# EAGLE design schematic_V3.1 (EAGLE 9.6.2)
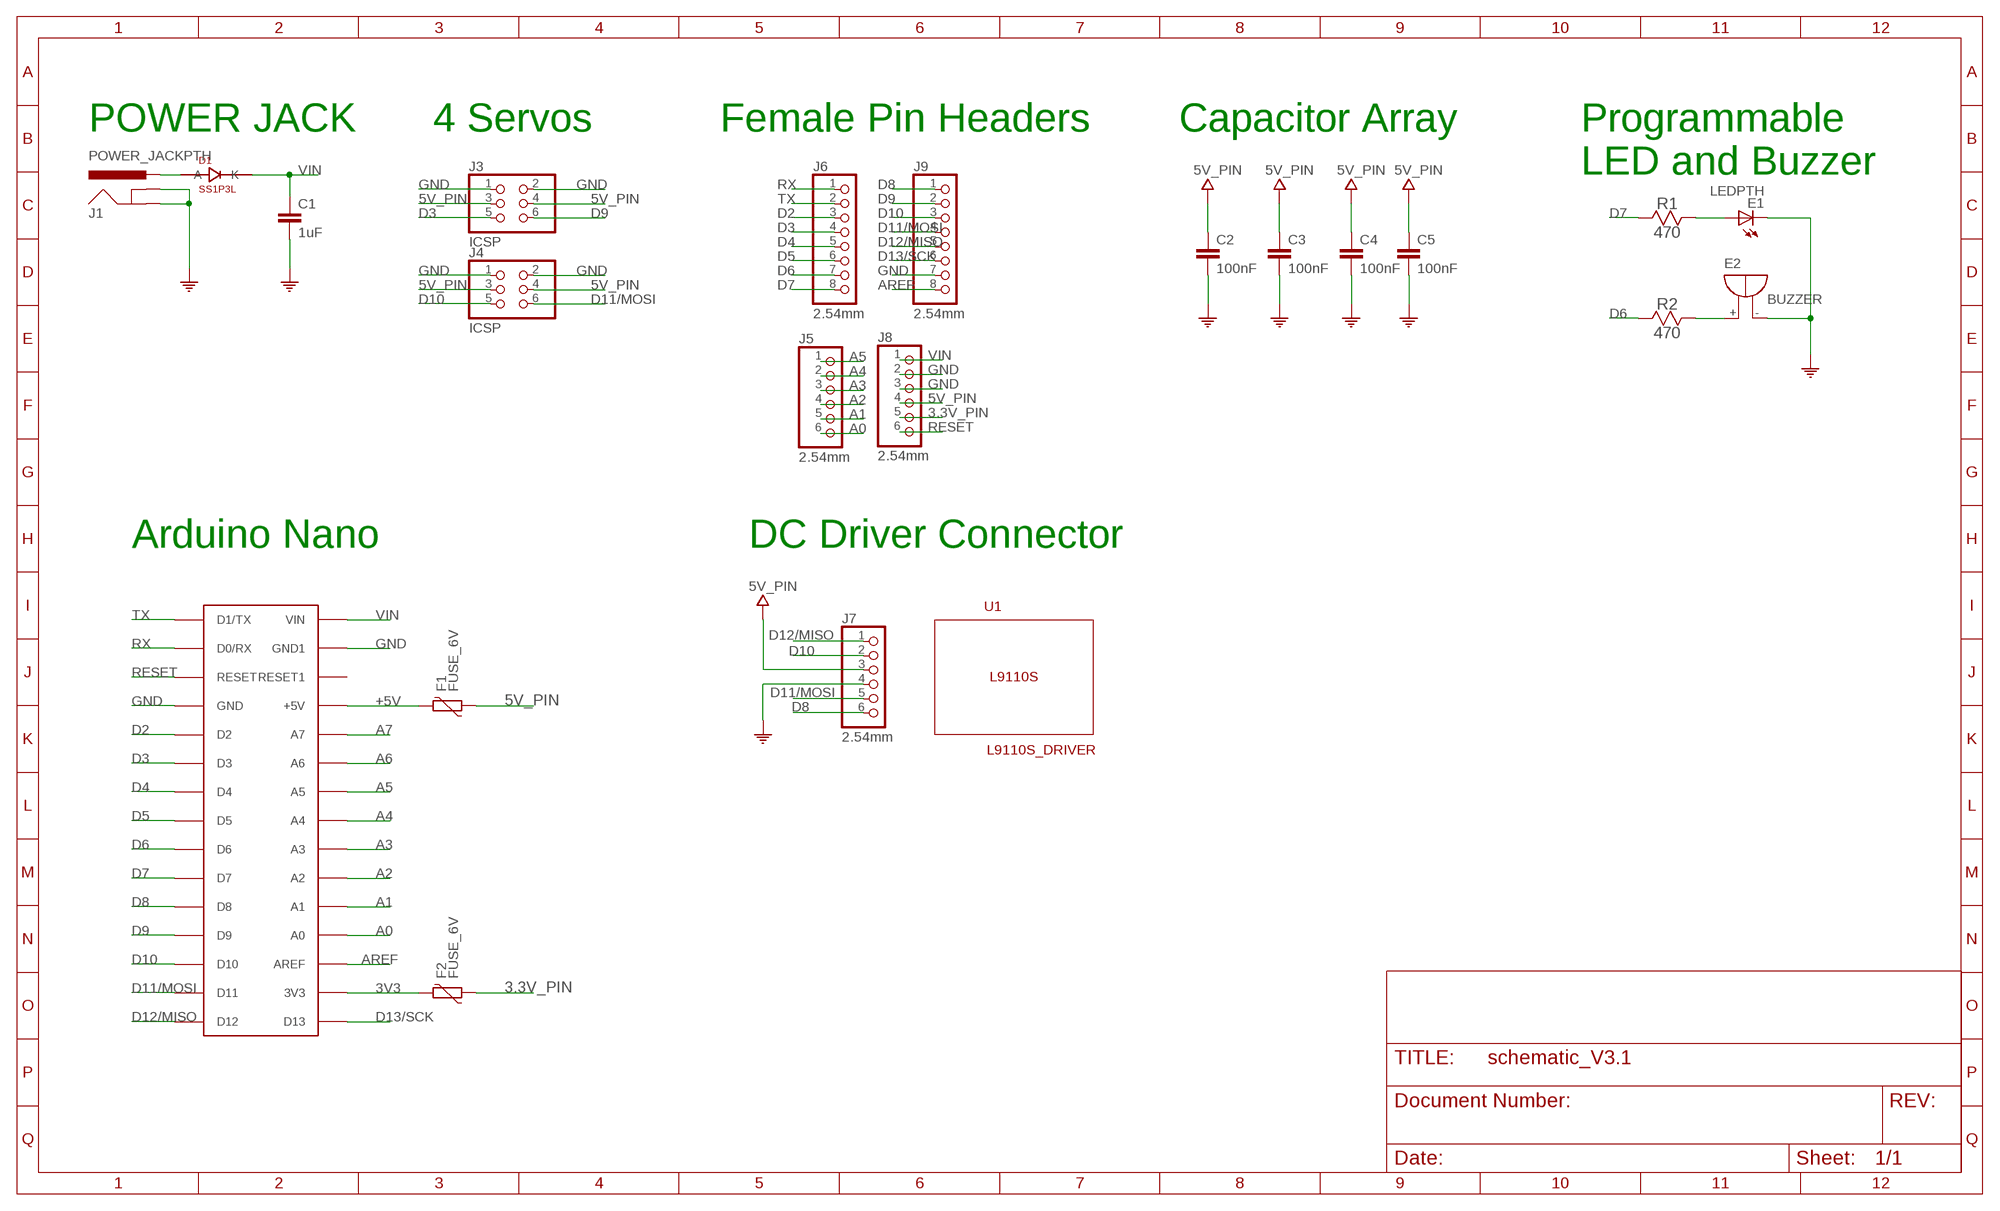
[diagram p0: schematic, sheet 1]

## Parts
C1  1uF  CAPACITOR_1UF_0603  [C0603-ROUND]
C2  100nF  CAPACITOR_100NF_0603  [C0603-ROUND]
C3  100nF  CAPACITOR_100NF_0603  [C0603-ROUND]
C4  100nF  CAPACITOR_100NF_0603  [C0603-ROUND]
C5  100nF  CAPACITOR_100NF_0603  [C0603-ROUND]
D1  SS1P3L  SCHOTTKY_DIODE  [DIODI_DO220AAL]
E1  LEDPTH  [LED5MM]
E2  BUZZER  [BUZZER]
F1  FUSE_6V  [FUSE_0603]
F2  FUSE_6V  [FUSE_0603]
J1  POWER_JACKPTH  [POWER_JACK_PTH]
J3  ICSP  CONNECTOR_2X3  [CONNECTOR_2X3]
J4  ICSP  CONNECTOR_2X3  [CONNECTOR_2X3]
J5  2.54mm  PINHD-1X6  [1X06]
J6  2.54mm  PINHD-1X8  [1X08]
J7  2.54mm  PINHD-1X6  [1X06]
J8  2.54mm  PINHD-1X6  [1X06]
J9  2.54mm  PINHD-1X8  [1X08]
R1  470  RESISTOR  [RESISTOR_PTH]
R2  470  RESISTOR  [RESISTOR_PTH]
U1  L9110S_DRIVER  [L9110S_DRIVER]
U$1  ARDUINONANO  [PDIP-32]

## Nets
3.3V_PIN: F2.1 J8.5
3V3: F2.2 U$1.3V3
5V_PIN: C2.1 C3.1 C4.1 C5.1 F1.1 J3.3 J3.4 J4.3 J4.4 J7.3 J8.4
+5V: F1.2 U$1.+5V
A0: J5.6 U$1.A7(A0)
A1: J5.5 U$1.A6(A1)
A2: J5.4 U$1.A5(A2)
A3: J5.3 U$1.A4(A3)
A4: J5.2 U$1.A3(A4)
A5: J5.1 U$1.A2(A5)
A6: U$1.A1(A6)
A7: U$1.A0(A7)
AREF: J9.8 U$1.AREF
D2: J6.3 U$1.D2
D3: J3.5 J6.4 U$1.D3
D4: J6.5 U$1.D4
D5: J6.6 U$1.D5
D6: J6.7 R2.1 U$1.D6
D7: J6.8 R1.1 U$1.D7
D8: J7.6 J9.1 U$1.D8
D9: J3.6 J9.2 U$1.D9
D10: J4.5 J7.2 J9.3 U$1.D10
D11/MOSI: J4.6 J7.5 J9.4 U$1.D11
D12/MISO: J7.1 J9.5 U$1.D12
D13/SCK: J9.6 U$1.D13
GND: C1.2 C2.2 C3.2 C4.2 C5.2 E1.K(C) E2.- J1.GND J1.GNDBREAK J3.1 J3.2 J4.1 J4.2 J7.4 J8.2 J8.3 J9.7 U$1.GND U$1.GND1
N$16: D1.P$2(A) J1.PWR
N$18: E1.A R1.2
N$19: E2.+ R2.2
RESET: J8.6 U$1.RESET
RX: J6.1 U$1.D0/RX
TX: J6.2 U$1.D1/TX
VIN: C1.1 D1.P$1(K) J8.1 U$1.VIN
Unconnected: U$1.RESET1

## Notes on the sheet
- POWER JACK | 4 Servos | Female Pin Headers | Capacitor Array
- Programmable 
  LED and Buzzer
- Arduino Nano | DC Driver Connector

## Library data of the parts
C1 = barnabas_noggin_V4:CAPACITOR_1UF_0603: 1uF 0603; PARTNO: CC0603KRX5R8BB105
C2-C5 = barnabas_noggin_V4:CAPACITOR_100NF_0603: CAP CER 0.1UF 50V Y5V 0603; PARTNO: CC0603ZRY5V9BB104
D1 = barnabas_noggin_V4:SCHOTTKY_DIODE: 1A 30V Schottky Barrier Rectifiers -SS1P3L-M3/84A; PARTNO: SS1P3L-M3/84A
E1 = barnabas_noggin_V4:LEDPTH
E2 = barnabas_noggin_V4:BUZZER: BUZZER Source: Buerklin; OC_FARNELL: unknown; OC_NEWARK: unknown
F1 F2 = barnabas_noggin_V4:FUSE_6V: SMD PTC; PARTNO: MF-FSMF050X-2
J1 = barnabas_noggin_V4:POWER_JACK: Power Jack This is the standard 5.5mm barrel jack for power. The PTH is the most common, proven, reliable, footprint. All others are experimental. The Slot footprint only works if the mill layer is transmitted to the PCB fab house so be warned. Spark Fun Electronics SKU : PRT-00119. Mating wall wart : TOL-00298 (and others); PARTNO: EJ508A
J3 J4 = barnabas_noggin_V4:CONNECTOR_2X3: 3x2 M V h 8,5 mm p2,54; PARTNO: M20-9980346
J5 J7 J8 = barnabas_noggin_V4:PINHD-1X6: PIN HEADER; PARTNO: M20-7820646
J6 J9 = barnabas_noggin_V4:PINHD-1X8: PIN HEADER; PARTNO: PPTC081LFBN-RC
R1 R2 = barnabas_noggin_V4:RESISTOR
U1 = barnabas_noggin_V4:L9110S_DRIVER
U$1 = barnabas_noggin_V4:ARDUINONANO

## Board
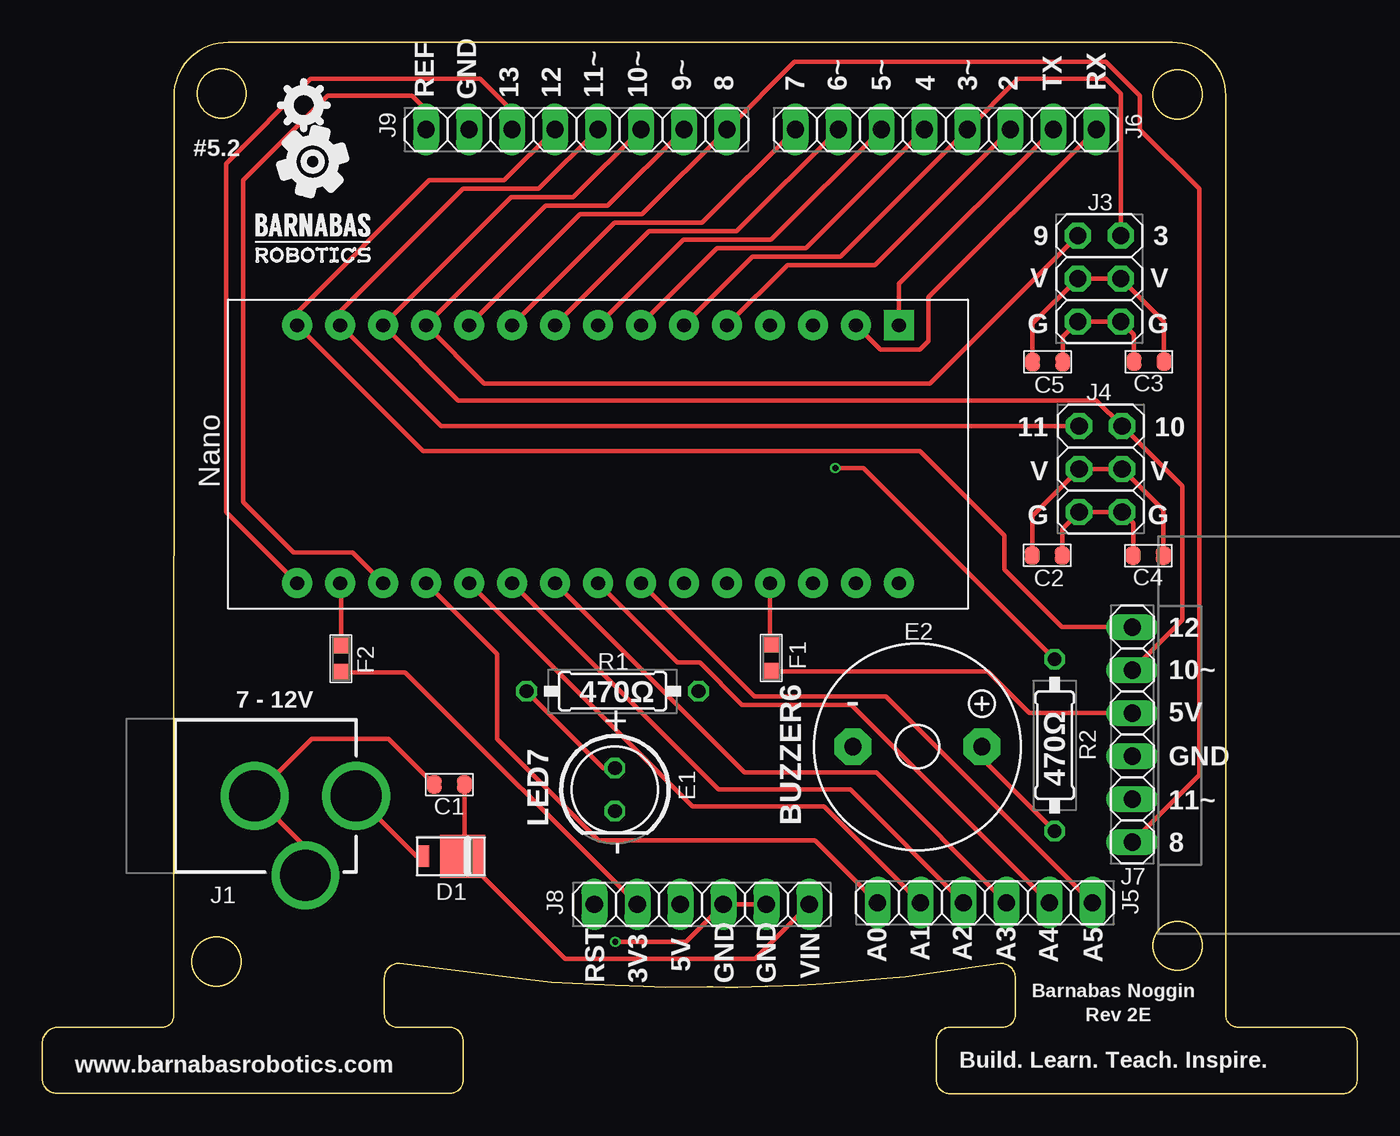
[diagram p1: board, top side]
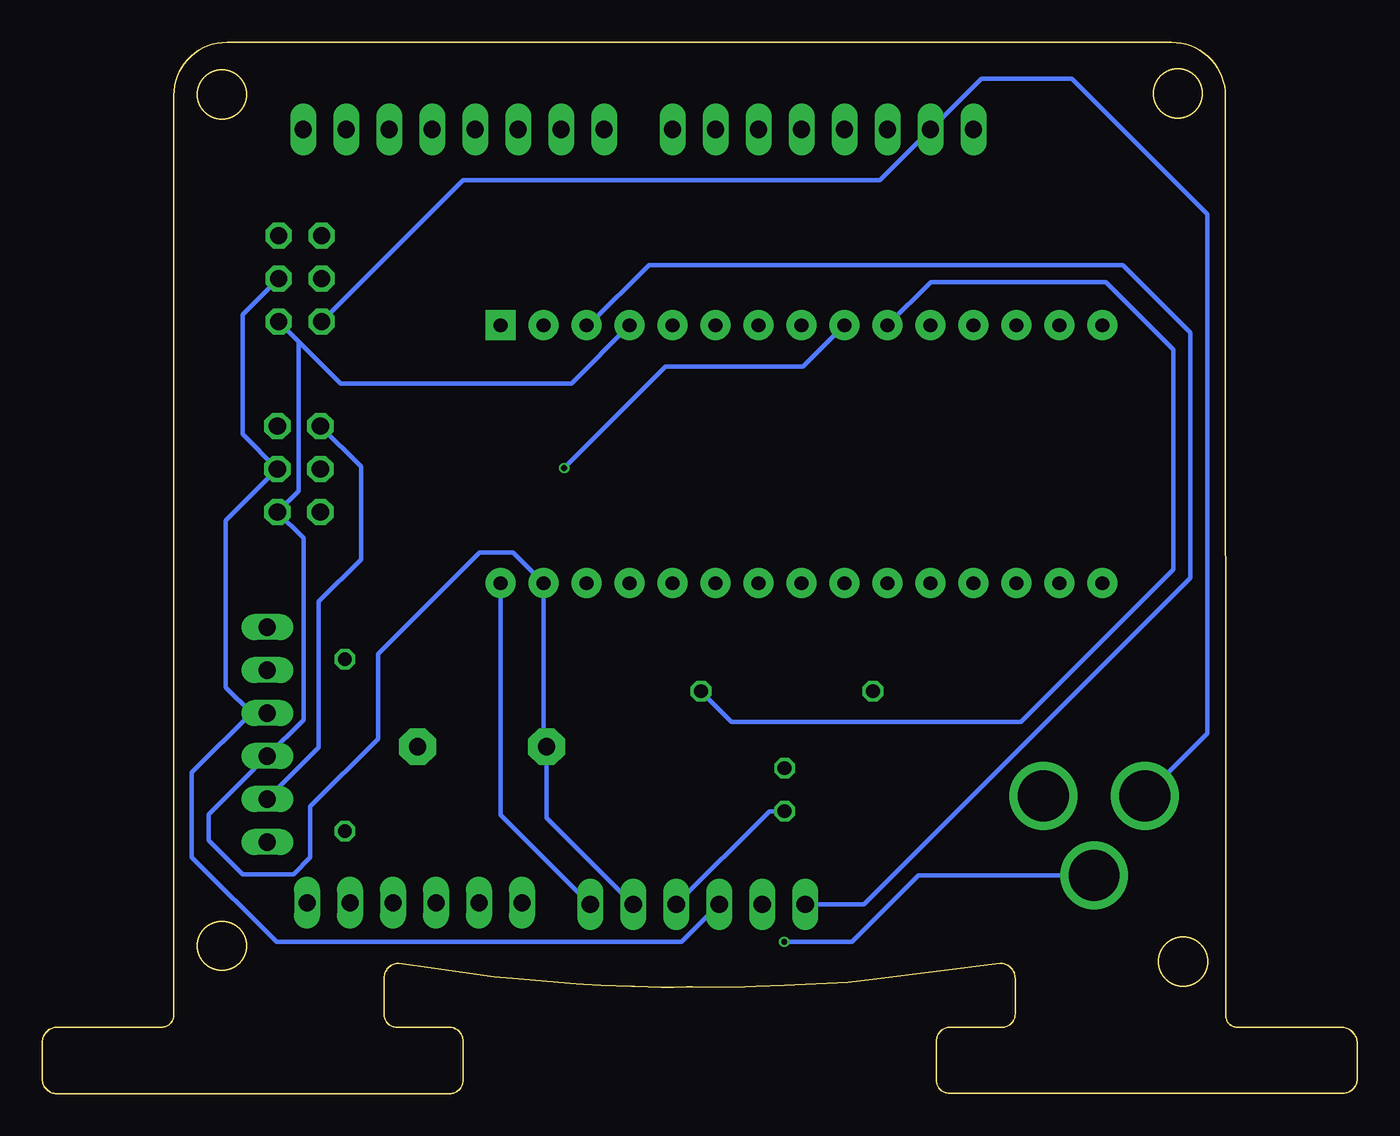
[diagram p2: board, bottom side, seen from below]

Size 77.7 x 62.13 mm. Coordinates in mm from the lower left corner, seen from the top.
Outline: 69.93,4.64 69.93,58.99 69.92,59.26 arc85 66.79,62.13 10.97,62.13 10.69,62.12 arc85 7.78,58.94 7.76,4.58 7.76,4.53 arc-85 7.11,3.93 0.96,3.93 0.88,3.93 arc85 0,2.97 0,0.86 arc90 0.83,0.03 24.13,0.03 24.2,0.03 arc85 24.86,0.76 24.86,3.13 24.86,3.2 arc85 24.07,3.92 20.99,3.92 20.92,3.92 arc-85 20.21,4.7 20.21,6.82 20.21,6.9 arc-85 21.1,7.71 28.63,6.75 30.08,6.59 33.83,6.41 35.54,6.34 36.82,6.27 39.28,6.3 39.63,6.31 40.36,6.29 40.66,6.28 41.1,6.29 42.71,6.34 42.88,6.34 44.67,6.41 45.71,6.47 46.16,6.49 49.92,6.81 51,6.91 54.53,7.39 56.63,7.71 56.7,7.71 arc-85 57.5,6.84 57.5,4.66 57.5,4.6 arc-85 56.77,3.93 53.66,3.93 53.59,3.93 arc85 52.84,3.11 52.84,0.78 52.84,0.71 arc85 53.62,0 76.86,0 76.93,0 arc85 77.7,0.84 77.7,3.03 77.7,3.11 arc85 76.8,3.93 70.64,3.93 70.58,3.93 arc-85 69.93,4.64
Outline: circle at 67.1,8.73 radius 1.45
Outline: circle at 10.6,59.12 radius 1.45
Outline: circle at 67.1,59.06 radius 1.45
Outline: circle at 10.28,7.81 radius 1.45
Copper layers (1*16): Top 0.035559375mm / dielectric 1.6mm / Bottom 0.035559375mm
Design rules "oshpark-2layer": minimum track width 6mil, minimum drill 10mil, track to track 6mil, track to pad 6mil, pad to pad 6mil, via to via 6mil, smd to smd 6mil, copper to edge 15mil, drill to drill 6mil, minimum pad ring 5mil, minimum via ring 5mil, stop-mask expansion 2.5mil, vias tented up to drill 0mil, thermal gap 10mil

### Footprints (pad centres in the part's own frame; a part is rotated, then mirrored left to right if it is on the bottom)
C0603-ROUND = smd 0.898 x 1.1: 1 -0.889,0; 2 0.889,0
DIODI_DO220AAL = smd 2.667 x 2.54: P$1 -0.7,0 | smd 0.762 x 1.27: P$2 1.65,0
LED5MM = drill 0.813 octagon: A -1.27,0; K 1.27,0
BUZZER = drill 1.016 pad 2.159 octagon: + 3.81,0; - -3.81,0
FUSE_0603 = smd 0.95 x 1: 1 -0.8,0; 2 0.8,0
POWER_JACK_PTH = drill 2.997: GND 0,7.7; GNDBREAK 4.7,10.7; PWR 0,13.7
CONNECTOR_2X3 = drill 1.016 pad 1.55 octagon: 1 -2.54,-1.27; 2 -2.54,1.27; 3 0,-1.27; 4 0,1.27; 5 2.54,-1.27; 6 2.54,1.27
1X06 = drill 1.016 long: 1 -6.35,0; 2 -3.81,0; 3 -1.27,0; 4 1.27,0; 5 3.81,0; 6 6.35,0
1X08 = drill 1.016 long: 1 -8.89,0; 2 -6.35,0; 3 -3.81,0; 4 -1.27,0; 5 1.27,0; 6 3.81,0; 7 6.35,0; 8 8.89,0
RESISTOR_PTH = drill 0.813 octagon: 1 -5.08,0; 2 5.08,0
PDIP-32 = drill 0.8 pad 1.778: 3V3 15.24,-35.56; +5V 15.24,-10.16; A0 15.24,-12.7; A1 15.24,-15.24; A2 15.24,-17.78; A3 15.24,-20.32; A4 15.24,-22.86; A5 15.24,-25.4; A6 15.24,-27.94; A7 15.24,-30.48; AREF 15.24,-33.02; D0/RX 0,-5.08; D2 0,-12.7; D3 0,-15.24; D4 0,-17.78; D5 0,-20.32; D6 0,-22.86; D7 0,-25.4; D8 0,-27.94; D9 0,-30.48; D10 0,-33.02; D11 0,-35.56; D12 0,-38.1; D13 15.24,-38.1; GND 0,-10.16; GND1 15.24,-5.08; RESET 0,-7.62; RESET1 15.24,-7.62; VIN 15.24,-2.54 | drill 0.8 pad 1.778 square: D1/TX 0,-2.54

### Placement (x,y rotation side)
C1  24.05,18.26 180 top
C2  59.38,31.81 0 top
C3  65.39,43.26 180 top
C4  65.36,31.8 180 top
C5  59.41,43.23 0 top
D1  24.14,14.03 180 top
E1  33.84,17.96 270 top
E2  51.71,20.5 0 top
F1  43.09,25.75 90 top
F2  17.65,25.7 90 top
J1  4.85,17.59 270 top
J3  62.46,48.16 90 top
J4  62.54,36.91 90 top
J5  55.7,11.28 180 top
J6  53.39,56.98 180 top
J7  64.41,21.22 270 top
J8  38.97,11.19 180 top
J9  31.56,56.98 180 top
R1  33.7,23.78 180 top
R2  59.83,20.59 270 top
U1  65.96,32.93 270 top
U$1  53.16,45.41 270 top

### Tracks (layer width: path | path; a pad name or v marks a point on that pad's centre or on a via)
3.3V_PIN
  Top 0.254: F2.1 21.44,24.9 J8.5
3V3
  Top 0.254: U$1.3V3 17.65,30.12 F2.2
5V_PIN
  Top 0.254: F1.1 55.88,24.95 58.34,22.49 J7.3 | C5.1 58.52,45.49 J3.4 J3.3 66.28,45.61 C3.1 | C2.1 58.5,34.14 J4.4 J4.3 66.25,34.48 C4.1
  Bottom 0.254: J8.4 39.92,8.97 63.86,8.97 68.86,13.97 68.86,18.97 65.34,22.49 | 65.34,22.49 J7.3 | J3.3 65.86,46.03 65.86,38.96 J4.3 66.86,33.87 66.86,24 65.34,22.49
+5V
  Top 0.254: U$1.+5V 43,26.63 F1.2
A0
  Top 0.254: U$1.A7 26.86,25.99 26.86,20.97 32.86,14.97 45.66,14.97 J5.6
A1
  Top 0.254: J5.5 46.2,16.97 38.42,16.97 U$1.A6
A2
  Top 0.254: J5.4 47.74,17.97 39.96,17.97 U$1.A5
A3
  Top 0.254: J5.3 49.28,18.97 41.5,18.97 U$1.A4
A4
  Top 0.254: J5.2 47.82,22.97 41.36,22.97 38.86,25.47 37.54,25.47 U$1.A3
A5
  Top 0.254: J5.1 49.86,23.47 42.08,23.47 U$1.A2
AREF
  Top 0.254: J9.8 22.67,58.16 21.86,58.97 16.86,58.97 11.86,53.97 11.86,34.97 14.86,31.97 18.34,31.97 U$1.AREF
D2
  Top 0.254: J6.3 49.19,48.97 44.02,48.97 U$1.D2
D3
  Top 0.254: U$1.D3 41.98,49.47 47.15,49.47 J6.4 57.65,59.97 62.86,59.97 63.73,59.1 J3.5
D4
  Top 0.254: J6.5 45.11,49.97 39.86,49.97 35.38,45.49 U$1.D4
D5
  Top 0.254: J6.6 43.07,50.47 37.9,50.47 U$1.D5
D6  (via drill 0.35)
  Top 0.254: J6.7 41.03,50.97 35.86,50.97 U$1.D6 | R2.1 48.52,36.97 v46.86,36.97
  Bottom 0.254: U$1.D6 32.74,42.97 40.86,42.97 v46.86,36.97
D7
  Top 0.254: J6.8 38.99,51.47 33.82,51.47 U$1.D7
  Bottom 0.254: R1.1 36.96,21.97 19.86,21.97 10.86,30.97 10.86,43.97 14.86,47.97 25.2,47.97 U$1.D7
D8
  Top 0.254: U$1.D8 31.78,51.97 35.45,51.97 J9.1 44.45,60.97 62.86,60.97 64.86,58.97 64.86,56.97 68.36,53.47 68.36,18.82 J7.6
D9
  Top 0.254: J9.2 33.41,52.47 29.74,52.47 U$1.D9 26.12,41.97 52.46,41.97 J3.6
D10
  Top 0.254: J9.3 31.36,52.97 27.7,52.97 U$1.D10 24.58,40.97 62.3,40.97 J4.5 67.36,35.91 67.36,27.98 J7.2
D11/MOSI
  Top 0.254: J9.4 29.32,53.47 24.86,53.47 17.6,46.21 U$1.D11 23.55,39.45 J4.6
  Bottom 0.254: J7.5 61.36,20.45 61.36,29.07 58.86,31.57 58.86,37.05 J4.6
D12/MISO
  Top 0.254: J9.5 27.29,53.97 22.86,53.97 15.06,46.17 U$1.D12 22.5,37.97 51.86,37.97 56.86,32.97 56.86,30.97 60.26,27.57 J7.1
D13/SCK
  Top 0.254: U$1.D13 10.86,34.37 10.86,54.97 15.86,59.97 25.86,59.97 27.75,58.08 J9.6
GND  (via drill 0.35)
  Top 0.254: J1.GNDBREAK 15.55,14.59 J1.GND 15.92,20.97 20.45,20.97 C1.2 | J8.2 J8.3 38.03,8.97 v33.86,8.97 | C5.2 60.3,44.73 J3.2 J3.1 64.5,44.85 C3.2 | C2.2 60.27,33.38 J4.2 J4.1 64.47,33.72 C4.2
  Bottom 0.254: J1.GND 8.86,21.28 8.86,51.97 16.86,59.97 22.22,59.97 J9.7 28.22,53.97 52.84,53.97 J3.2 | J8.3 34.74,16.69 E1.K | J8.2 47.9,16.31 E2.- 48.08,20.68 U$1.GND1 49.88,31.97 51.86,31.97 57.86,25.97 57.86,20.97 61.86,16.97 61.86,13.97 62.86,12.97 65.86,12.97 67.86,14.97 67.86,16.49 J7.4 62.26,22.09 62.26,32.82 J4.1 62.56,35.62 62.56,44.45 J3.1 60.08,41.97 46.44,41.97 U$1.GND | J1.GNDBREAK 25.94,12.89 29.86,8.97 v33.86,8.97
N$16
  Top 0.254: J1.PWR 22.11,14.03 D1.P$2
N$18
  Top 0.254: E1.A 33.17,19.23 R1.2
N$19
  Top 0.254: E2.+ 55.52,19.81 R2.2
RESET
  Bottom 0.254: J8.6 29.14,11.19 9.86,30.47 9.86,44.97 13.86,48.97 41.86,48.97 45.42,45.41 U$1.RESET
RX
  Top 0.254: J6.1 52.36,47.06 52.36,44.47 51.86,43.97 49.52,43.97 U$1.D0/RX
TX
  Top 0.254: U$1.D1/TX 50.62,47.86 J6.2
VIN
  Top 0.254: C1.1 24.94,14.13 D1.P$1 30.89,7.97 42.11,7.97 J8.1
  Bottom 0.254: U$1.VIN 50.62,16.48 J8.1

### Text on the board
tPlace: REF | GND | 13 | 12 | 11~ | 10~ | 9~ | 8 | 7 | 6~ | 5~ | 4 | 3~ | 2 | TX | RX | #5.2 | 9 | 3 | V | V | G | G | 11 | 10 | V | V | G | G | 12 | 7 - 12V | 470Ω | 10~ | - | 5V | + | LED7 | GND | 470Ω | 11~ | BUZZER6 | - | 8 | A0 | A1 | A2 | A3 | A4 | A5 | RST | 3V3 | 5V | GND | GND | VIN | Barnabas Noggin | Rev 2E | Build. Learn. Teach. Inspire. | www.barnabasrobotics.com